# Altium schematic sheet LED_POWER 2.SchDoc
size A
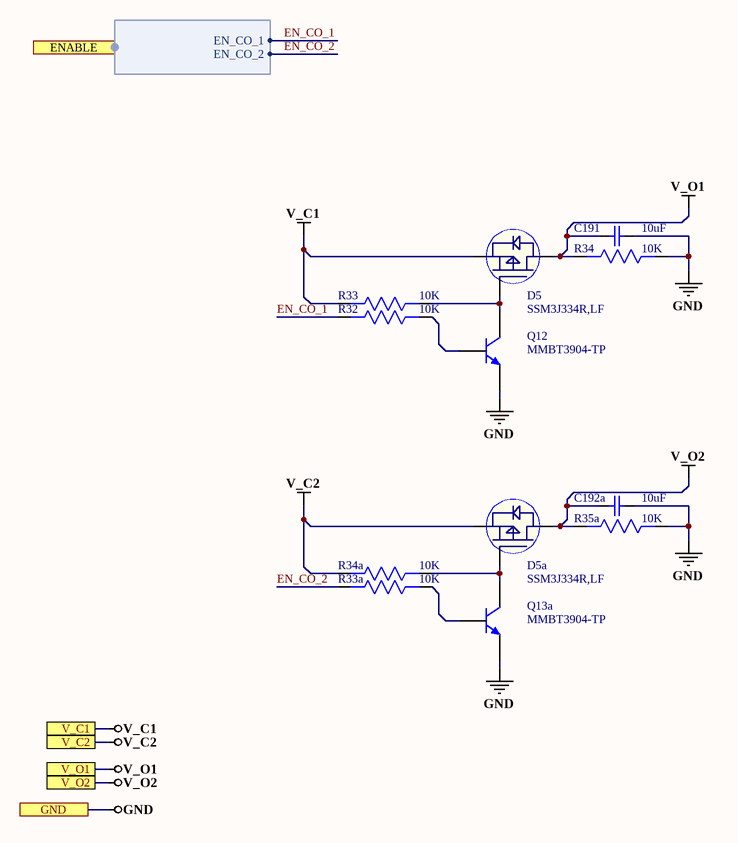
[diagram p0: LED_POWER 2.SchDoc]

## Parts
C191  10uF  [Cap0603]
C192a  10uF  [Cap0603]
D5  SSM3J334R,LF  [SOT-23F]
D5a  SSM3J334R,LF  [SOT-23F]
Q12  MMBT3904-TP  [SOT-23F]
Q13a  MMBT3904-TP  [SOT-23F]
R32  10K  [Res-0201]
R33  10K  [Res-0201]
R33a  10K  [Res-0201]
R34  10K  [Res-0201]
R34a  10K  [Res-0201]
R35a  10K  [Res-0201]

## Ports
ENABLE (harness Harness_2), GND, V_C1, V_C2, V_O1, V_O2

## Harnesses
Harness_2: EN_CO_1, EN_CO_2

## Nets
GND: C191.1 C192a.1 Q12.2(E) Q13a.2(E) R34.1 R35a.1 ; port GND
V_C1: D5.2(S) R33.2 ; port V_C1
V_C2: D5a.2(S) R34a.2 ; port V_C2
V_O1: C191.2 D5.3(D) R34.2 ; port V_O1
V_O2: C192a.2 D5a.3(D) R35a.2 ; port V_O2
EN_CO_1: R32.2 ; port ENABLE.EN_CO_1
EN_CO_2: R33a.2 ; port ENABLE.EN_CO_2
NetD5_1: D5.1(G) Q12.3(C) R33.1
NetD5a_1: D5a.1(G) Q13a.3(C) R34a.1
NetQ12_1: Q12.1(B) R32.1
NetQ13a_1: Q13a.1(B) R33a.1

## Library data of the parts
C191 C192a = GRM188R61E106KA73D: CAP CER 10UF 25V X5R 0603; Manufacturer: Murata; Supplier 1: Mouser; Manufacturer Part Number: GRM188R61E106KA73D; RoHS: Yes; Category: Ceramic Capacitors; Stock 1: 319428; Pricing 1: 1=0.36000, 10=0.25800, 50=0.25800, 100=0.15500, 1000=0.09800, 10000=0.06900 (USD); Case/Package: 0603; RoHS Compliant: Yes; ComponentLink1URL: https://search.murata.co.jp/Ceramy/image/img/A01X/G101/ENG/GRM188R61E106KA73-01.pdf?src-supplier=Digi-Key; ComponentLink1Description: https://search.murata.co.jp/Ceramy/image/img/A01X/G101/ENG/GRM188R61E106KA73-01.pdf?src-supplier=Digi-Key; Supplier Part Number 1: 81-GRM188R61E106KA3D
D5 D5a = SSM3J334R,LF: MOSFET P-CH 30V 4A SOT23F; Manufacturer: Toshiba; Number of Elements: 1; Element Configuration: Single; Drain to Source Breakdown Voltage: -30V; Rds On Max: 71mR; Input Capacitance: 280pF; Gate to Source Voltage (Vgs): 20V; Drain to Source Resistance: 136mR; Power Dissipation: 1W; Supplier 1: Digi-Key; Manufacturer Part Number: SSM3J334R,LF; RoHS: Yes; Category: MOSFETs; Stock 1: 79343; Pricing 1: 1=0.47000, 10=0.33100, 25=0.30800, 100=0.16720, 500=0.13640, 1000=0.10120 (USD); Mount: Surface Mount; Case/Package: SOT-23-3; Number of Pins: 3; Min Operating Temperature: -55°C; Max Operating Temperature: 150°C; Packaging: Tape and Reel; Package Quantity: 1; Drain to Source Voltage (Vdss): 30V; Continuous Drain Current (ID): 4A; Max Power Dissipation: 1W; ComponentLink1URL: https://datasheet.ciiva.com/6375/ssm3j334r-datasheet-en-20140301-6375723.pdf?src-supplier=Digi-Key; ComponentLink1Description: https://datasheet.ciiva.com/6375/ssm3j334r-datasheet-en-20140301-6375723.pdf?src-supplier=Digi-Key; ComponentLink2URL: https://datasheet.ciiva.com/6373/ssm3j334r-datasheet-en-20140301-6373837.pdf?src-supplier=Digi-Key; ComponentLink2Description: https://datasheet.ciiva.com/6373/ssm3j334r-datasheet-en-20140301-6373837.pdf?src-supplier=Digi-Key; Supplier Part Number 1: SSM3J334RLFCT-ND
Q12 Q13a = MMBT3904-TP: TRANS NPN 40V 0.2A SOT23; Manufacturer: MCC; Max Power Dissipation: 350mW; Number of Elements: 1; hFE Min: 40; Frequency: 300MHz; Max Collector Current: 200mA; Collector Base Voltage (VCBO): 60V; Emitter Base Voltage (VEBO): 6V; Collector Emitter Saturation Voltage: 300mV; Element Configuration: Single; Current Rating: 100mA; Supplier 1: Digi-Key; Manufacturer Part Number: MMBT3904-TP; RoHS: Yes; Category: BJTs; Stock 1: 659192; Pricing 1: 1=0.10000, 10=0.06300, 25=0.06000, 100=0.03380, 500=0.02656, 1000=0.01844 (USD); Mount: Surface Mount; Case/Package: SOT-23; Number of Pins: 3; Min Operating Temperature: -55°C; Max Operating Temperature: 150°C; Package Quantity: 1; Collector Emitter Voltage (VCEO): 40V; Packaging: Tape and Reel; Transition Frequency: 300MHz; Collector Emitter Breakdown Voltage: 40V; Polarity: NPN; Max Breakdown Voltage: 40V; Power Dissipation: 350mW; Max Frequency: 300MHz; Gain Bandwidth Product: 300MHz; Voltage Rating (DC): 40V; Series: -; Collector-emitter Voltage-Max: 300mV; Length: 3.04mm; Width: 1.4mm; Height: 1.12mm; Radiation Hardening: No; Lead Free: Lead Free; RoHS Compliant: Yes; ComponentLink1URL: https://datasheet.ciiva.com/16291/mmbt3904sot-23-37005-16291911.pdf?src-supplier=Mouser; ComponentLink1Description: https://datasheet.ciiva.com/16291/mmbt3904sot-23-37005-16291911.pdf?src-supplier=Mouser; ComponentLink2URL: https://datasheet.ciiva.com/15139/getdatasheetpartid-251950-15139820.pdf?src-supplier=Verical; ComponentLink2Description: https://datasheet.ciiva.com/15139/getdatasheetpartid-251950-15139820.pdf?src-supplier=Verical; ComponentLink3URL: https://datasheet.ciiva.com/972/mmbt3904sot-23-972515.pdf?src-supplier=Digi-Key; ComponentLink3Description: https://datasheet.ciiva.com/972/mmbt3904sot-23-972515.pdf?src-supplier=Digi-Key; ComponentLink4URL: https://datasheet.ciiva.com/16742/mmbt3904tsot-523-16742101.pdf?src-supplier=Future+Electronics; ComponentLink4Description: https://datasheet.ciiva.com/16742/mmbt3904tsot-523-16742101.pdf?src-supplier=Future+Electronics; ComponentLink5URL: https://datasheet.ciiva.com/972/mmbt3904sot-23-972516.pdf?src-supplier=Digi-Key; ComponentLink5Description: https://datasheet.ciiva.com/972/mmbt3904sot-23-972516.pdf?src-supplier=Digi-Key; ComponentLink6URL: https://datasheet.ciiva.com/14546/70055699-14546053.pdf?src-supplier=Allied+Electronics; ComponentLink6Description: https://datasheet.ciiva.com/14546/70055699-14546053.pdf?src-supplier=Allied+Electronics; Supplier Part Number 1: MMBT3904TPMSCT-ND
R32 R33 R33a R34 R34a R35a = RC0201FR-0710KL: GENERAL 0201 11% REEL (7INCH); Manufacturer: Yageo; Temperature Coefficient: 200ppm/°C; Resistance: 10kR; Tolerance: 1%; Max Power Dissipation: 50mW; Working Voltage: 25V; Supplier 1: Digi-Key; Manufacturer Part Number: RC0201FR-0710KL; RoHS: Yes; Category: Chip SMD Resistors; Stock 1: 6892350; Pricing 1: 1=0.10000, 10=0.03600, 100=0.01480, 1000=0.00665, 2500=0.00577, 5000=0.00477 (USD); Case/Package: 0201; Number of Pins: 2; Contact Plating: Tin,Matte; Weight: 6E-06oz; Case Code (Imperial): 0201; Case Code (Metric): 0603; Min Operating Temperature: -55°C; Max Operating Temperature: 125°C; Resistor Type: Thick Film; Features: Moisture Resistant; Termination: SMD/SMT; Number of Terminations: 2; Power Rating: 50mW; Voltage Rating: 25V; Packaging: Tape and Reel; Package Quantity: 1; Voltage Rating (DC): 25V; Length: 0.6mm; Width: 0.3mm; Height: 0.01inch; Depth: 0.3mm; Radiation Hardening: No; REACH SVHC: No SVHC; Military Standard: Not; Lead Free: Lead Free; ComponentLink1URL: https://datasheet.ciiva.com/2467/pyu-r-int-thick-7-2467109.pdf?src-supplier=Digi-Key; ComponentLink1Description: https://datasheet.ciiva.com/2467/pyu-r-int-thick-7-2467109.pdf?src-supplier=Digi-Key; ComponentLink2URL: https://datasheet.ciiva.com/2467/pyu-r-int-thick-7-2467110.pdf?src-supplier=Digi-Key; ComponentLink2Description: https://datasheet.ciiva.com/2467/pyu-r-int-thick-7-2467110.pdf?src-supplier=Digi-Key; ComponentLink3URL: https://datasheet.ciiva.com/2467/pyu-r-int-thick-7-2467111.pdf?src-supplier=Digi-Key; ComponentLink3Description: https://datasheet.ciiva.com/2467/pyu-r-int-thick-7-2467111.pdf?src-supplier=Digi-Key; ComponentLink4URL: https://datasheet.ciiva.com/7660/1421516-7660807.pdf?src-supplier=Element14; ComponentLink4Description: https://datasheet.ciiva.com/7660/1421516-7660807.pdf?src-supplier=Element14; ComponentLink5URL: https://datasheet.ciiva.com/8891/pyu-rc0201-51-rohs-l-8-8891384.pdf?src-supplier=Avnet; ComponentLink5Description: https://datasheet.ciiva.com/8891/pyu-rc0201-51-rohs-l-8-8891384.pdf?src-supplier=Avnet; ComponentLink6URL: https://datasheet.ciiva.com/28405/pyu-rc0201-51-rohs-l-8-28405609.pdf?src-supplier=Avnet+Europe; ComponentLink6Description: https://datasheet.ciiva.com/28405/pyu-rc0201-51-rohs-l-8-28405609.pdf?src-supplier=Avnet+Europe; ComponentLink7URL: https://datasheet.ciiva.com/26829/getdatasheetpartid-421074-26829851.pdf?src-supplier=Verical; ComponentLink7Description: https://datasheet.ciiva.com/26829/getdatasheetpartid-421074-26829851.pdf?src-supplier=Verical; ComponentLink8URL: https://datasheet.ciiva.com/46391/1421516-46391339.pdf?src-supplier=Element14; ComponentLink8Description: https://datasheet.ciiva.com/46391/1421516-46391339.pdf?src-supplier=Element14; ComponentLink9URL: https://datasheet.ciiva.com/16855/pyu-rc0201-51-rohs-l-8-16855789.pdf?src-supplier=Avnet+Europe; ComponentLink9Description: https://datasheet.ciiva.com/16855/pyu-rc0201-51-rohs-l-8-16855789.pdf?src-supplier=Avnet+Europe; Supplier Part Number 1: 311-10.0KMCT-ND